# EAGLE design 2716_adapter (EAGLE 6.5.0)
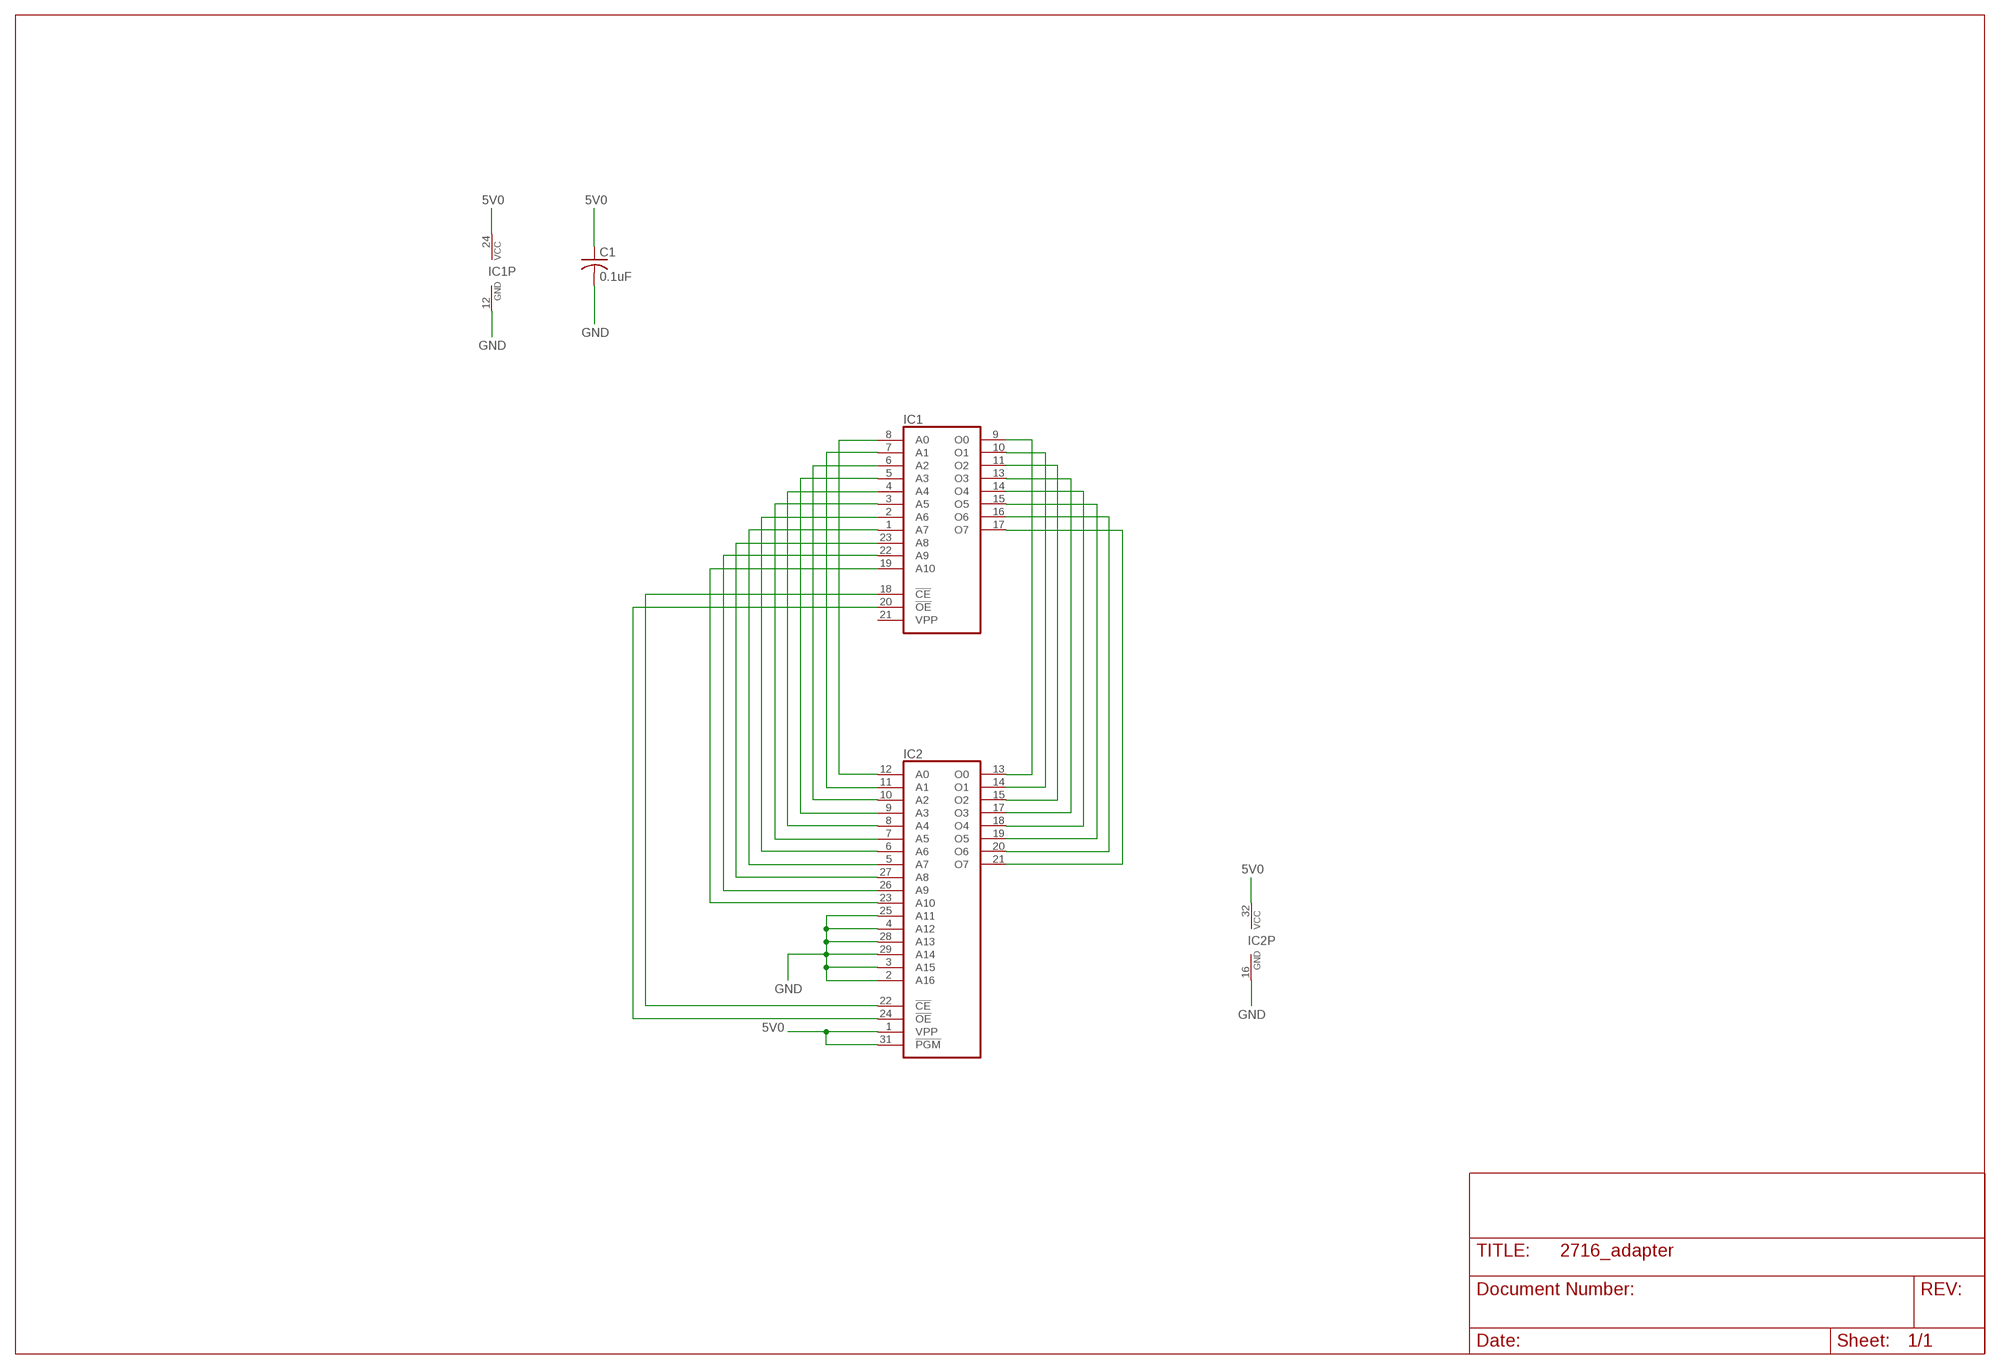
[diagram p0: schematic, sheet 1]

## Parts
C1  0.1uF  C-USC0603K  [C0603K]
IC1  2716  [DIL24]
IC2  27010PLCC32  [PLCC32R]

## Nets
5V0: C1.1 IC1.24(VCC) IC2.1(VPP) IC2.31(!PGM) IC2.32(VCC)
GND: C1.2 IC1.12(GND) IC2.2(A16) IC2.3(A15) IC2.4(A12) IC2.16(GND) IC2.25(A11) IC2.28(A13) IC2.29(A14)
N$1: IC1.9(O0) IC2.13(O0)
N$2: IC1.10(O1) IC2.14(O1)
N$3: IC1.11(O2) IC2.15(O2)
N$4: IC1.13(O3) IC2.17(O3)
N$5: IC1.14(O4) IC2.18(O4)
N$6: IC1.15(O5) IC2.19(O5)
N$7: IC1.16(O6) IC2.20(O6)
N$8: IC1.17(O7) IC2.21(O7)
N$9: IC1.8(A0) IC2.12(A0)
N$10: IC1.7(A1) IC2.11(A1)
N$11: IC1.6(A2) IC2.10(A2)
N$12: IC1.5(A3) IC2.9(A3)
N$13: IC1.4(A4) IC2.8(A4)
N$14: IC1.3(A5) IC2.7(A5)
N$15: IC1.2(A6) IC2.6(A6)
N$16: IC1.1(A7) IC2.5(A7)
N$17: IC1.23(A8) IC2.27(A8)
N$18: IC1.22(A9) IC2.26(A9)
N$19: IC1.19(A10) IC2.23(A10)
N$20: IC1.18(!CE) IC2.22(!CE)
N$21: IC1.20(!OE) IC2.24(!OE)
Unconnected: IC1.21(VPP)

## Library data of the parts
C1 = rcl:C-US: CAPACITOR, American symbol
IC1 = memory:2716: MEMORY
IC2 = memory-joe:27010: MEMORY

## Board
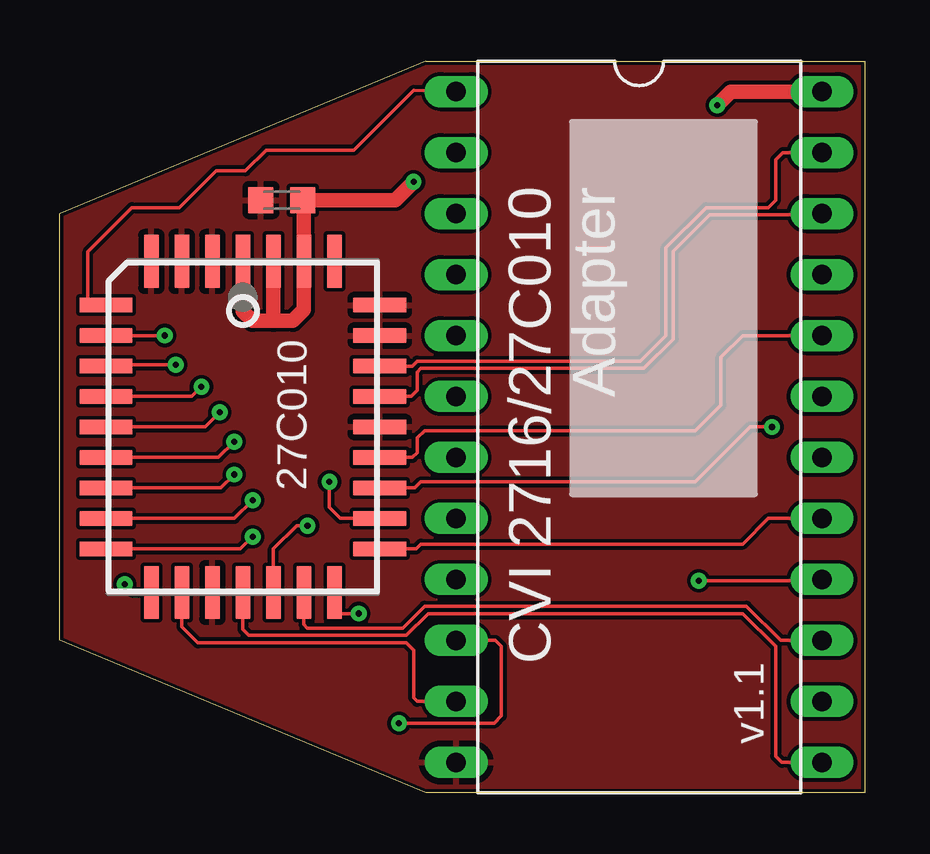
[diagram p1: board, top side]
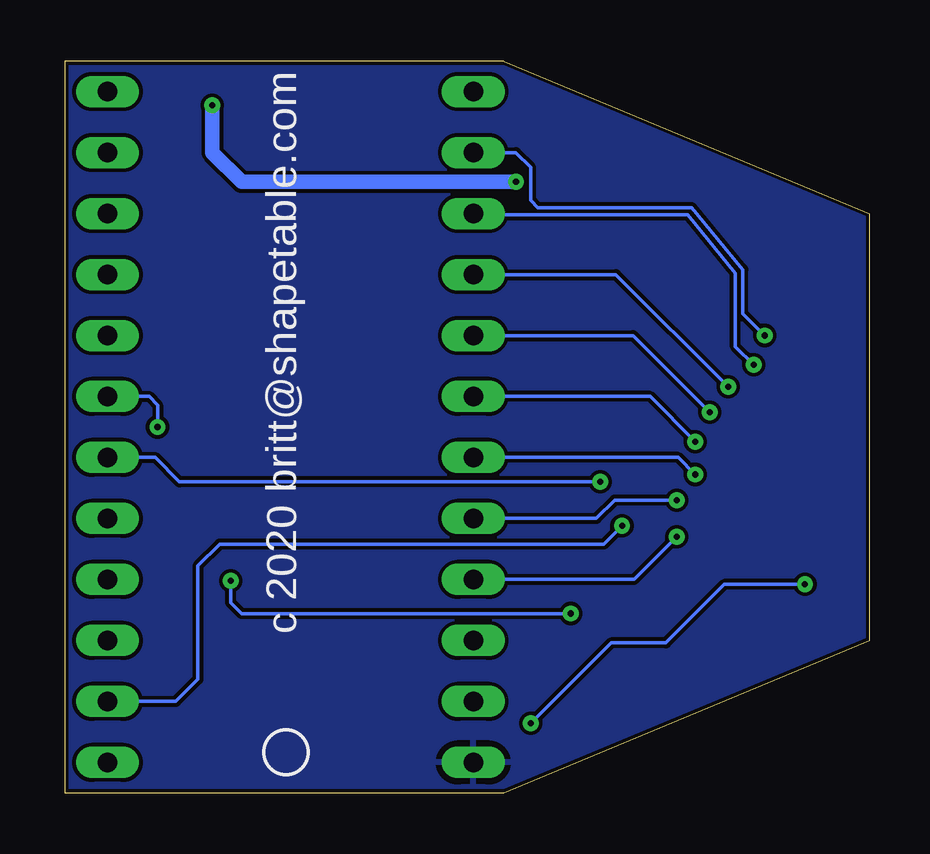
[diagram p2: board, bottom side, seen from below]

Size 33.53 x 30.48 mm. Coordinates in mm from the lower left corner, seen from the top.
Outline: 0,6.35 0,24.13 15.24,30.48 33.53,30.48 33.53,0 15.24,0 0,6.35
Copper layers (1*16): Top 0.035mm / dielectric 1.5mm / Bottom 0.035mm
Design rules "default *": minimum track width 6mil, minimum drill 10mil, track to track 6mil, track to pad 6mil, pad to pad 6mil, via to via 6mil, smd to smd 6mil, copper to edge 6mil, drill to drill 6mil, minimum pad ring 10mil, minimum via ring 8mil, stop-mask expansion 4mil, vias tented up to drill 10mil, thermal gap 10mil

### Footprints (pad centres in the part's own frame; a part is rotated, then mirrored left to right if it is on the bottom)
C0603K = smd 1.05 x 1.08: 1 -0.875,0; 2 0.875,0
DIL24 = drill 0.813 long: 1 -13.97,-7.62; 2 -11.43,-7.62; 3 -8.89,-7.62; 4 -6.35,-7.62; 5 -3.81,-7.62; 6 -1.27,-7.62; 7 1.27,-7.62; 8 3.81,-7.62; 9 6.35,-7.62; 10 8.89,-7.62; 11 11.43,-7.62; 12 13.97,-7.62; 13 13.97,7.62; 14 11.43,7.62; 15 8.89,7.62; 16 6.35,7.62; 17 3.81,7.62; 18 1.27,7.62; 19 -1.27,7.62; 20 -3.81,7.62; 21 -6.35,7.62; 22 -8.89,7.62; 23 -11.43,7.62; 24 -13.97,7.62
PLCC32R = smd 0.6 x 2.2: 1 0,6.9; 2 -1.27,6.9; 3 -2.54,6.9; 4 -3.81,6.9; 14 -3.81,-6.9; 15 -2.54,-6.9; 16 -1.27,-6.9; 17 0,-6.9; 18 1.27,-6.9; 19 2.54,-6.9; 20 3.81,-6.9; 30 3.81,6.9; 31 2.54,6.9; 32 1.27,6.9 | smd 2.2 x 0.6: 5 -5.7,5.08; 6 -5.7,3.81; 7 -5.7,2.54; 8 -5.7,1.27; 9 -5.7,0; 10 -5.7,-1.27; 11 -5.7,-2.54; 12 -5.7,-3.81; 13 -5.7,-5.08; 21 5.7,-5.08; 22 5.7,-3.81; 23 5.7,-2.54; 24 5.7,-1.27; 25 5.7,0; 26 5.7,1.27; 27 5.7,2.54; 28 5.7,3.81; 29 5.7,5.08

### Placement (x,y rotation side)
C1  9.25,24.69 180 top
IC1  24.13,15.24 270 top
IC2  7.62,15.24 0 top

### Tracks (layer width: path | path; a pad name or v marks a point on that pad's centre or on a via)
5V0  (via drill 0.25)
  Top 0.61: v14.73,25.45 13.97,24.69 C1.1 10.16,24.5 IC2.31 10.16,20.12 9.7,19.66 8.89,19.66 | 8.89,19.66 8.03,19.66 7.62,20.07 IC2.1 | IC1.24 27.94,29.21 v27.38,28.65 | IC2.32 8.89,19.66
  Bottom 0.61: v14.73,25.45 26.16,25.45 27.38,26.67 v27.38,28.65
GND
  pour Bottom (isolate 0.152): -1.27,0 -1.27,30.48 34.04,30.48 34.04,0
  pour Top (isolate 0.152): -1.27,0 -1.27,30.48 34.04,30.48 34.04,0
N$1  (via drill 0.25)
  Top 0.152: IC2.13 7.52,10.16 v8.03,10.67
  Bottom 0.152: v8.03,10.67 9.8,8.89 IC1.9
N$2  (via drill 0.25)
  Top 0.152: IC1.10 18.14,6.35 18.39,6.1 18.39,3.2 18.09,2.9 v14.12,2.9 | IC2.14 3.04,8.34 v2.69,8.69
  Bottom 0.152: v2.69,8.69 6.05,8.69 8.48,6.25 10.77,6.25 v14.12,2.9
N$3
  Top 0.152: IC2.15 5.08,6.91 5.74,6.25 14.43,6.25 14.73,5.94 14.73,3.96 14.88,3.81 IC1.11
N$4
  Top 0.152: IC2.17 7.62,6.81 7.87,6.55 14.43,6.55 15.34,7.47 28.45,7.47 29.82,6.1 29.82,1.52 30.07,1.27 IC1.13
N$5  (via drill 0.25)
  Top 0.152: IC2.18 8.89,10.16 9.86,11.12 v10.31,11.12
  Bottom 0.152: v10.31,11.12 11.07,10.36 27.08,10.36 27.99,9.45 27.99,4.72 28.91,3.81 IC1.14
N$6
  Top 0.152: IC2.19 10.16,7.01 10.31,6.86 14.28,6.86 15.19,7.77 28.6,7.77 30.02,6.35 IC1.15
N$7  (via drill 0.25)
  Top 0.152: IC2.20 11.43,7.47 v12.45,7.47 | v26.62,8.84 31.7,8.84 arc90 IC1.16
  Bottom 0.152: v12.45,7.47 26.16,7.47 26.62,7.92 v26.62,8.84
N$8
  Top 0.152: IC2.21 14.83,10.16 15.04,10.36 28.45,10.36 29.52,11.43 IC1.17
N$9  (via drill 0.25)
  Top 0.152: IC2.12 7.26,11.43 v8.03,12.19
  Bottom 0.152: v8.03,12.19 10.62,12.19 11.38,11.43 IC1.8
N$10  (via drill 0.25)
  Top 0.152: IC2.11 6.71,12.7 v7.26,13.26
  Bottom 0.152: v7.26,13.26 7.98,13.97 IC1.7
N$11  (via drill 0.25)
  Top 0.152: IC2.10 6.6,13.97 v7.26,14.63
  Bottom 0.152: v7.26,14.63 9.14,16.51 IC1.6
N$12  (via drill 0.25)
  Top 0.152: IC2.9 6.05,15.24 v6.66,15.85
  Bottom 0.152: IC1.5 9.86,19.05 v6.66,15.85
N$13  (via drill 0.25)
  Top 0.152: IC2.8 5.49,16.51 v5.89,16.92
  Bottom 0.152: IC1.4 10.57,21.59 v5.89,16.92
N$14  (via drill 0.25)
  Top 0.152: IC2.7 1.97,17.83 v4.83,17.83
  Bottom 0.152: v4.83,17.83 5.59,18.59 5.59,21.64 7.57,24.08 16.51,24.08 IC1.3
N$15  (via drill 0.25)
  Top 0.152: IC2.6 v4.37,19.05
  Bottom 0.152: v4.37,19.05 5.28,19.96 5.28,21.79 7.42,24.38 13.82,24.38 14.12,24.69 14.12,26.06 14.73,26.67 IC1.2
N$16
  Top 0.152: IC2.5 1.32,20.42 1.16,20.42 1.16,22.55 3,24.38 4.98,24.38 6.5,25.91 7.72,25.91 8.59,26.77 12.24,26.77 14.73,29.26 IC1.1
N$17
  Top 0.152: IC2.27 14.68,17.78 14.88,17.98 24.18,17.98 25.25,19.05 25.25,22.71 26.92,24.38 29.52,24.38 29.82,24.69 29.82,26.36 30.12,26.67 IC1.23
N$18
  Top 0.152: IC2.26 14.63,16.51 14.88,16.76 14.88,17.53 15.04,17.68 24.33,17.68 25.55,18.9 25.55,22.55 27.08,24.08 31.75,24.08 IC1.22
N$19  (via drill 0.25)
  Top 0.152: IC2.23 14.78,12.7 15.04,12.95 26.47,12.95 28.75,15.24 v29.67,15.24
  Bottom 0.152: IC1.19 30.02,16.51 29.67,16.15 v29.67,15.24
N$20  (via drill 0.25)
  Top 0.152: IC2.22 11.68,11.43 11.23,11.89 v11.23,12.95
  Bottom 0.152: v11.23,12.95 28.75,12.95 29.77,13.97 IC1.18
N$21
  Top 0.152: IC2.24 14.68,13.97 14.88,14.17 14.88,14.78 15.19,15.09 26.47,15.09 27.53,16.15 27.53,18.14 28.45,19.05 IC1.20

### Text on the board
tPlace: CVI 2716/27C010 / Adapter | 27C010 | v1.1
bPlace: c 2020 britt@shapetable.com